# Altium schematic sheet Clamp Top.SchDoc
size 406 x 304 mm; SheetNumber: 9; SheetTotal: 14
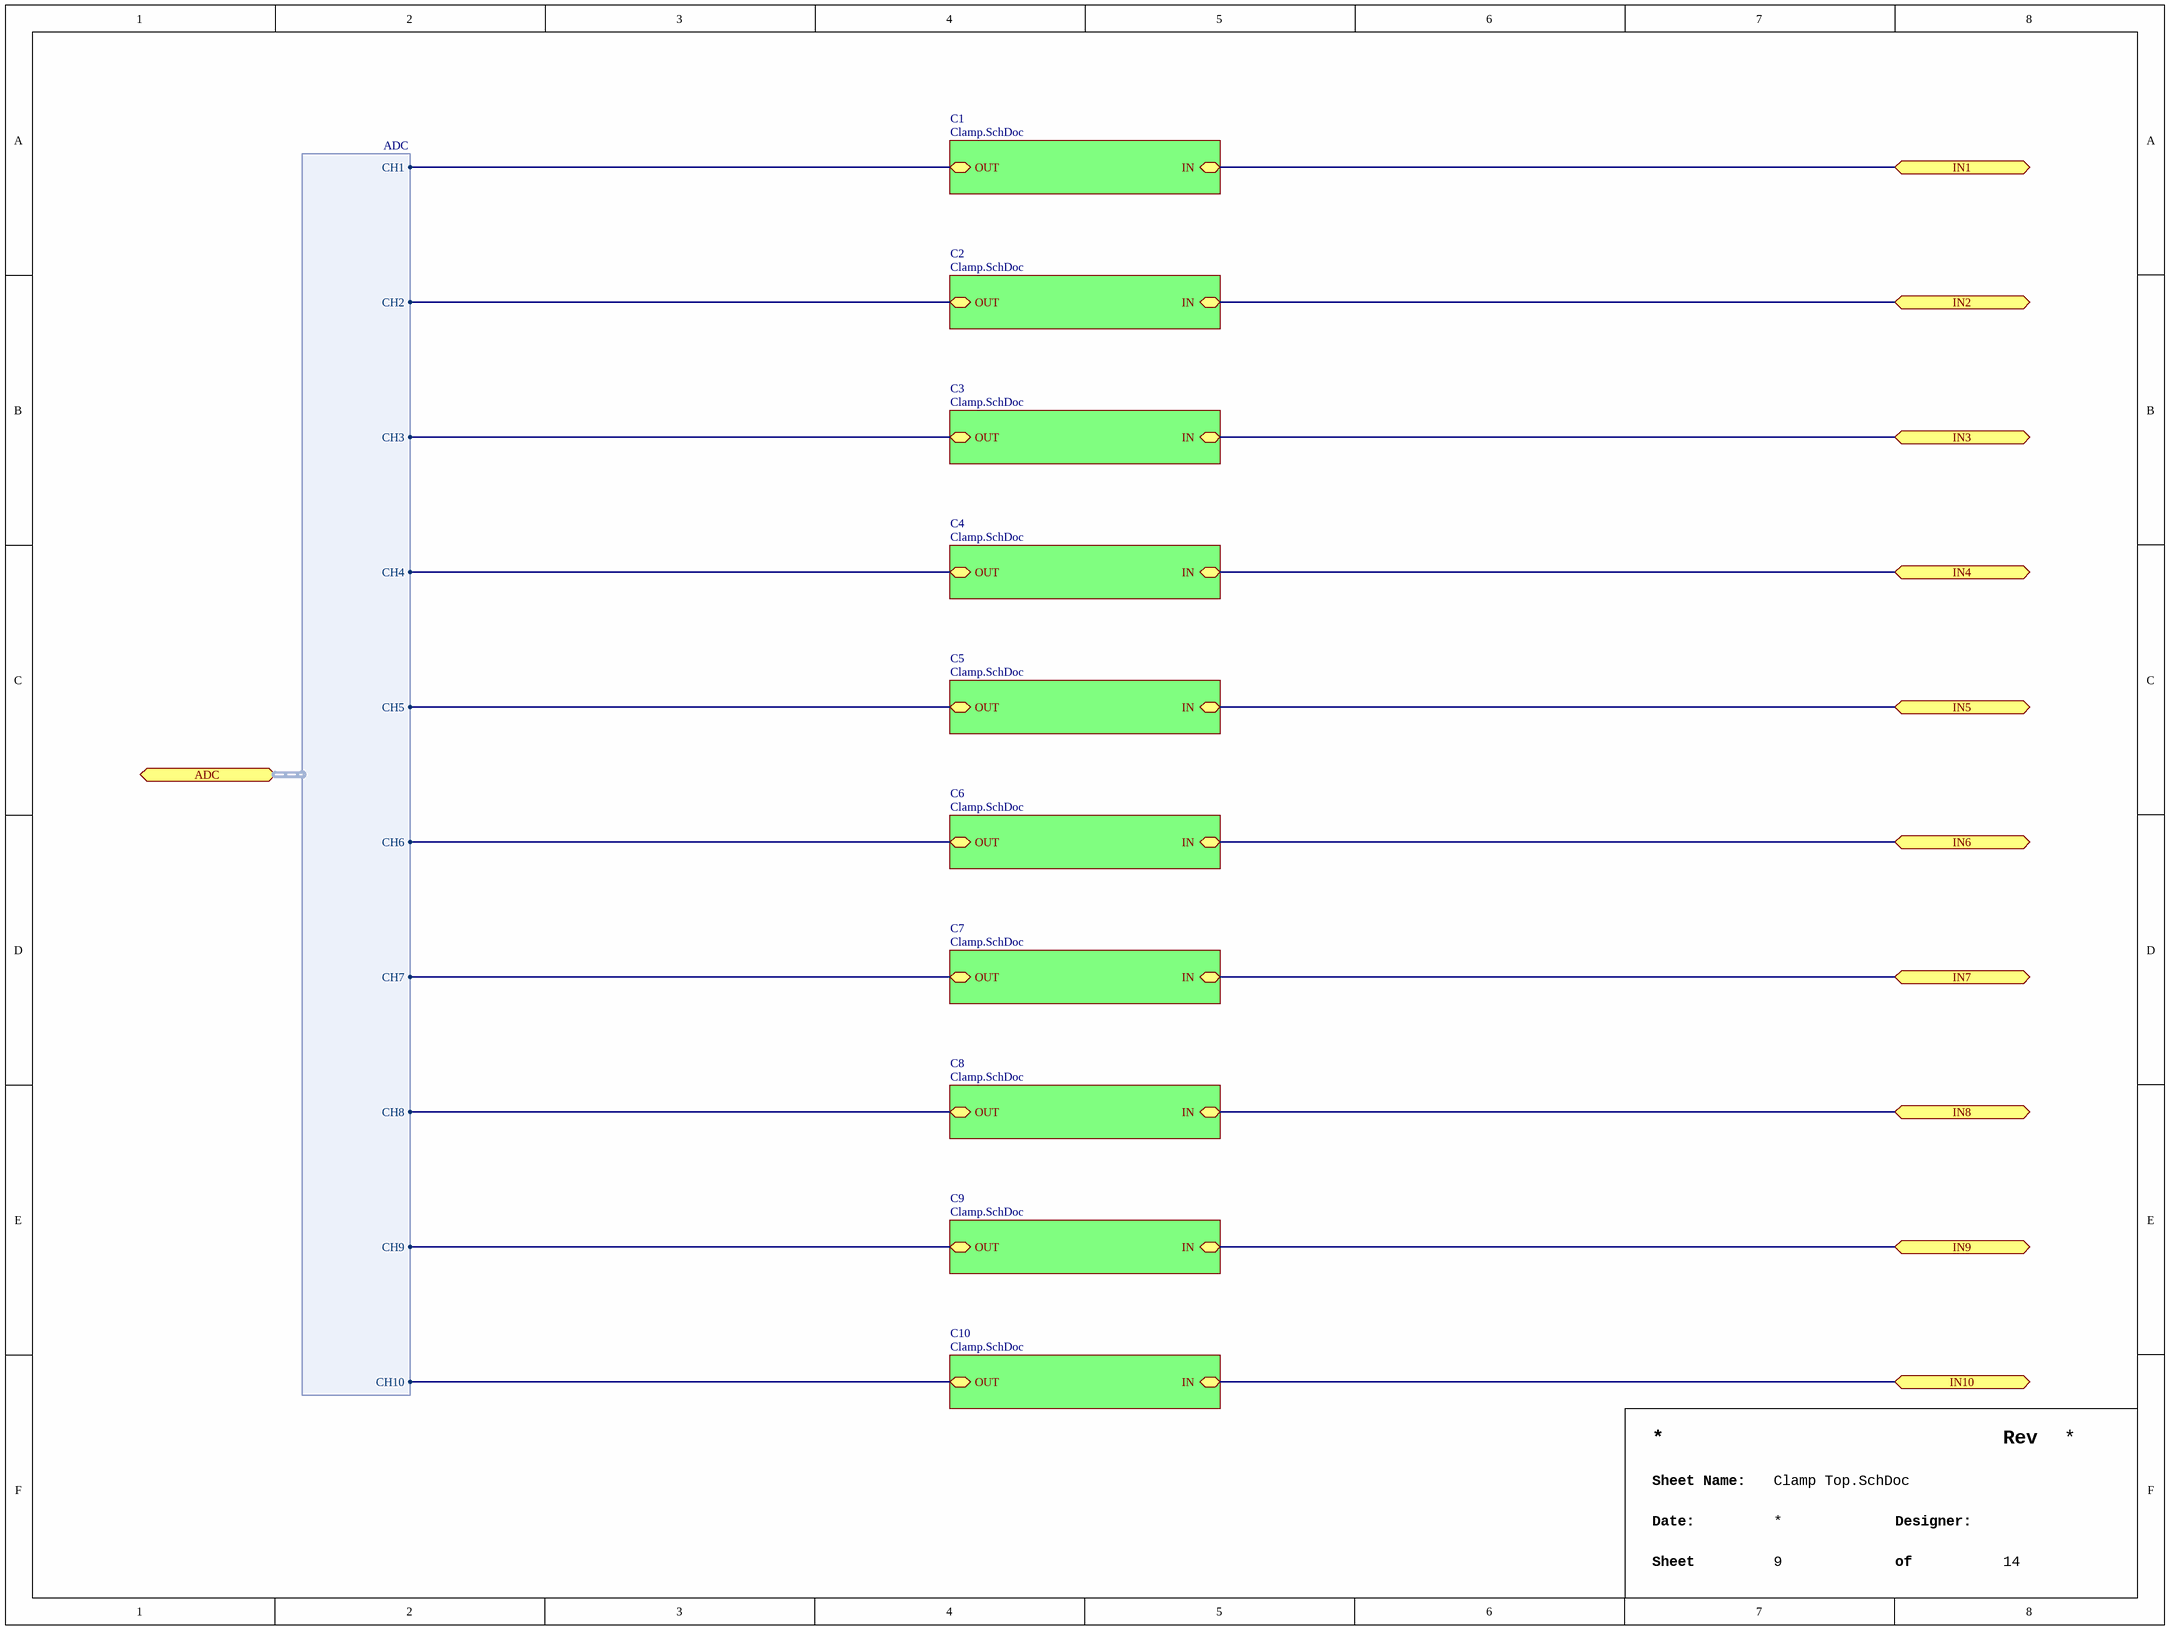
[diagram p0: Clamp Top.SchDoc]

## Sub-sheets
C1 = Clamp.SchDoc: IN (bidir), OUT (bidir)
C2 = Clamp.SchDoc: IN (bidir), OUT (bidir)
C3 = Clamp.SchDoc: IN (bidir), OUT (bidir)
C4 = Clamp.SchDoc: IN (bidir), OUT (bidir)
C5 = Clamp.SchDoc: IN (bidir), OUT (bidir)
C6 = Clamp.SchDoc: IN (bidir), OUT (bidir)
C7 = Clamp.SchDoc: IN (bidir), OUT (bidir)
C8 = Clamp.SchDoc: IN (bidir), OUT (bidir)
C9 = Clamp.SchDoc: IN (bidir), OUT (bidir)
C10 = Clamp.SchDoc: IN (bidir), OUT (bidir)

## Ports
ADC (bidir, harness ADC), IN1 (bidir), IN2 (bidir), IN3 (bidir), IN4 (bidir), IN5 (bidir), IN6 (bidir), IN7 (bidir), IN8 (bidir), IN9 (bidir), IN10 (bidir)

## Harnesses
ADC: CH10, CH1, CH2, CH3, CH4, CH5, CH6, CH7, CH8, CH9

## Nets
IN1: port IN1, sheet C1/IN
IN2: port IN2, sheet C2/IN
IN3: port IN3, sheet C3/IN
IN4: port IN4, sheet C4/IN
IN5: port IN5, sheet C5/IN
IN6: port IN6, sheet C6/IN
IN7: port IN7, sheet C7/IN
IN8: port IN8, sheet C8/IN
IN9: port IN9, sheet C9/IN
IN10: port IN10, sheet C10/IN
(unnamed): sheet C1/OUT, port ADC.CH1
(unnamed): sheet C2/OUT, port ADC.CH2
(unnamed): sheet C3/OUT, port ADC.CH3
(unnamed): sheet C4/OUT, port ADC.CH4
(unnamed): sheet C5/OUT, port ADC.CH5
(unnamed): sheet C6/OUT, port ADC.CH6
(unnamed): sheet C7/OUT, port ADC.CH7
(unnamed): sheet C8/OUT, port ADC.CH8
(unnamed): sheet C9/OUT, port ADC.CH9
(unnamed): sheet C10/OUT, port ADC.CH10

## Notes on the sheet
- Rev
- Sheet Name:
- Date:
- Sheet
- Designer:
- of